# Altium schematic sheet [01] - COVER PAGE.SchDoc
size Letter; CheckedBy: Pablo M.; DocumentNumber: 1; Revision: v1; SheetNumber: 1; SheetTotal: 5
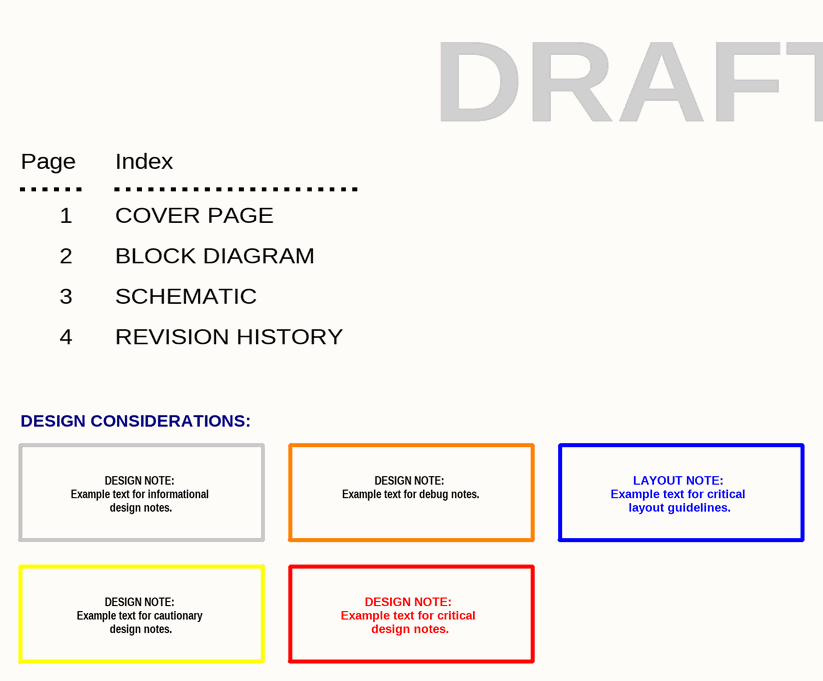
[diagram p0: [01] - COVER PAGE.SchDoc]

## Notes on the sheet
- Page
- Index
- DRAFT
- 1
- COVER PAGE
- 2
- 3
- BLOCK DIAGRAM
- SCHEMATIC
- 4
- REVISION HISTORY
- DESIGN CONSIDERATIONS:
- DESIGN NOTE:
  Example text for informational
  design notes.
- DESIGN NOTE:
  Example text for debug notes.
- LAYOUT NOTE:
  Example text for critical
  layout guidelines.
- DESIGN NOTE:
  Example text for cautionary
  design notes.
- DESIGN NOTE:
  Example text for critical
  design notes.
- Project Name:
- Page Contents:
- Size:
- Revision:
- Letter
- Design:
- Document Number:
- Date:
- Sheet:
- of